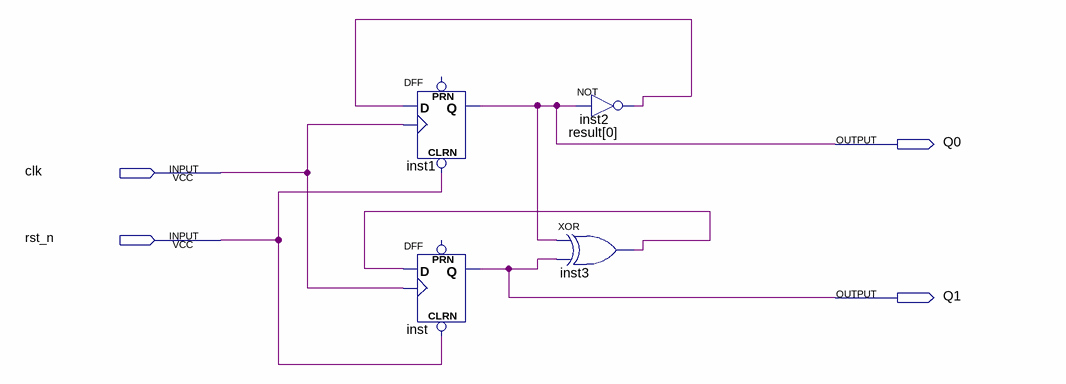
[diagram p0: schematic sheet]
// Quartus schematic count_4.bdf as structural Verilog: 4 symbols, 4 pins
module count_4 (
  input  clk,
  input  rst_n,
  output Q0,
  output Q1
);

  wire inst2_out, inst3_out;

  DFF inst1 (.CLRN(rst_n), .CLK(clk), .D(inst2_out), .Q(Q0));  // open: PRN
  DFF inst (.CLRN(rst_n), .CLK(clk), .D(inst3_out), .Q(Q1));  // open: PRN
  not inst2 (inst2_out, Q0);
  xor inst3 (inst3_out, Q0, Q1);

  // Other names for the same wires on the sheet: result[0] = Q0
endmodule
